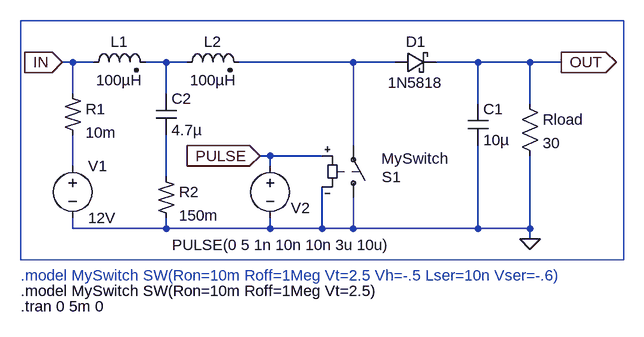
[diagram p0: schematic Switch-Mode_Power_Supplies_-_Basso-_Figure_1-65.asc]
Switch-Mode_Power_Supplies_-_Basso-_Figure_1-65.asc, the LTspice schematic file:
Version 4
SHEET 1 880 1052
WIRE -1216 -112 -1232 -112
WIRE -1184 -112 -1216 -112
WIRE -1072 -112 -1104 -112
WIRE -1040 -112 -1072 -112
WIRE -784 -112 -960 -112
WIRE -720 -112 -784 -112
WIRE -592 -112 -656 -112
WIRE -512 -112 -592 -112
WIRE -464 -112 -512 -112
WIRE -1216 -64 -1216 -112
WIRE -1072 -64 -1072 -112
WIRE -592 -48 -592 -112
WIRE -512 -48 -512 -112
WIRE -784 16 -784 -112
WIRE -912 32 -928 32
WIRE -832 32 -912 32
WIRE -1216 48 -1216 0
WIRE -912 48 -912 32
WIRE -1072 64 -1072 0
WIRE -1216 144 -1216 128
WIRE -1072 144 -1072 128
WIRE -1072 144 -1216 144
WIRE -912 144 -912 128
WIRE -912 144 -1072 144
WIRE -832 144 -832 80
WIRE -832 144 -912 144
WIRE -784 144 -784 96
WIRE -784 144 -832 144
WIRE -592 144 -592 16
WIRE -592 144 -784 144
WIRE -512 144 -512 32
WIRE -512 144 -592 144
WIRE -512 160 -512 144
FLAG -464 -112 OUT
IOPIN -464 -112 Out
FLAG -512 160 0
FLAG -1232 -112 IN
IOPIN -1232 -112 In
FLAG -928 32 PULSE
IOPIN -928 32 In
SYMBOL voltage -1216 32 R0
WINDOW 123 0 0 Left 0
WINDOW 39 0 0 Left 0
SYMATTR InstName V1
SYMATTR Value 12V
SYMBOL res -528 -64 R0
SYMATTR InstName Rload
SYMATTR Value 30
SYMBOL sw -784 112 M180
WINDOW 0 44 47 Left 0
WINDOW 3 43 76 Left 0
SYMATTR InstName S1
SYMATTR Value MySwitch
SYMBOL voltage -912 32 R0
WINDOW 0 32 80 Left 0
WINDOW 3 -151 137 Left 0
WINDOW 123 0 0 Left 0
WINDOW 39 0 0 Left 0
SYMATTR InstName V2
SYMATTR Value PULSE(0 5 1n 10n 10n 3u 10u)
SYMBOL ind2 -1200 -96 R270
WINDOW 0 32 56 VTop 0
WINDOW 3 4 56 VBottom 0
SYMATTR InstName L1
SYMATTR Value 100µH
SYMBOL cap -608 -48 R0
SYMATTR InstName C1
SYMATTR Value 10µ
SYMBOL schottky -720 -96 R270
WINDOW 0 32 32 VTop 0
WINDOW 3 0 32 VBottom 0
SYMATTR InstName D1
SYMATTR Value 1N5818
SYMATTR Description Diode
SYMATTR Type diode
SYMBOL res2 -1232 -64 R0
SYMATTR InstName R1
SYMATTR Value 10m
SYMBOL ind2 -1056 -96 R270
WINDOW 0 32 56 VTop 0
WINDOW 3 4 56 VBottom 0
SYMATTR InstName L2
SYMATTR Value 100µH
SYMBOL res2 -1088 64 R0
SYMATTR InstName R2
SYMATTR Value 150m
SYMBOL cap -1088 -64 R0
SYMATTR InstName C2
SYMATTR Value 4.7µ
TEXT -1296 264 Left 0 !.tran 0 5m 0
TEXT -1296 240 Left 0 !.model MySwitch SW(Ron=10m Roff=1Meg Vt=2.5)
TEXT -1296 216 Left 0 ;.model MySwitch SW(Ron=10m Roff=1Meg Vt=2.5 Vh=-.5 Lser=10n Vser=-.6)
RECTANGLE Normal -1296 -176 -368 192

The netlist it stands for:
* Switch-Mode_Power_Supplies_-_Basso-_Figure_1-65.asc
V1 N003 0 12V
Rload OUT 0 30
S1 0 N002 PULSE 0 MySwitch
V2 PULSE 0 PULSE(0 5 1n 10n 10n 3u 10u)
L1 IN N001 100µH
C1 OUT 0 10µ
D1 N002 OUT 1N5818
R1 IN N003 10m
L2 N001 N002 100µH
R2 N004 0 150m
C2 N001 N004 4.7µ
.model D D
.lib standard.dio
.tran 0 5m 0
.model MySwitch SW(Ron=10m Roff=1Meg Vt=2.5)
* .model MySwitch SW(Ron=10m Roff=1Meg Vt=2.5 Vh=-.5 Lser=10n Vser=-.6)
.backanno
.end